# EAGLE design pcb_v2 (EAGLE 8.7.1)
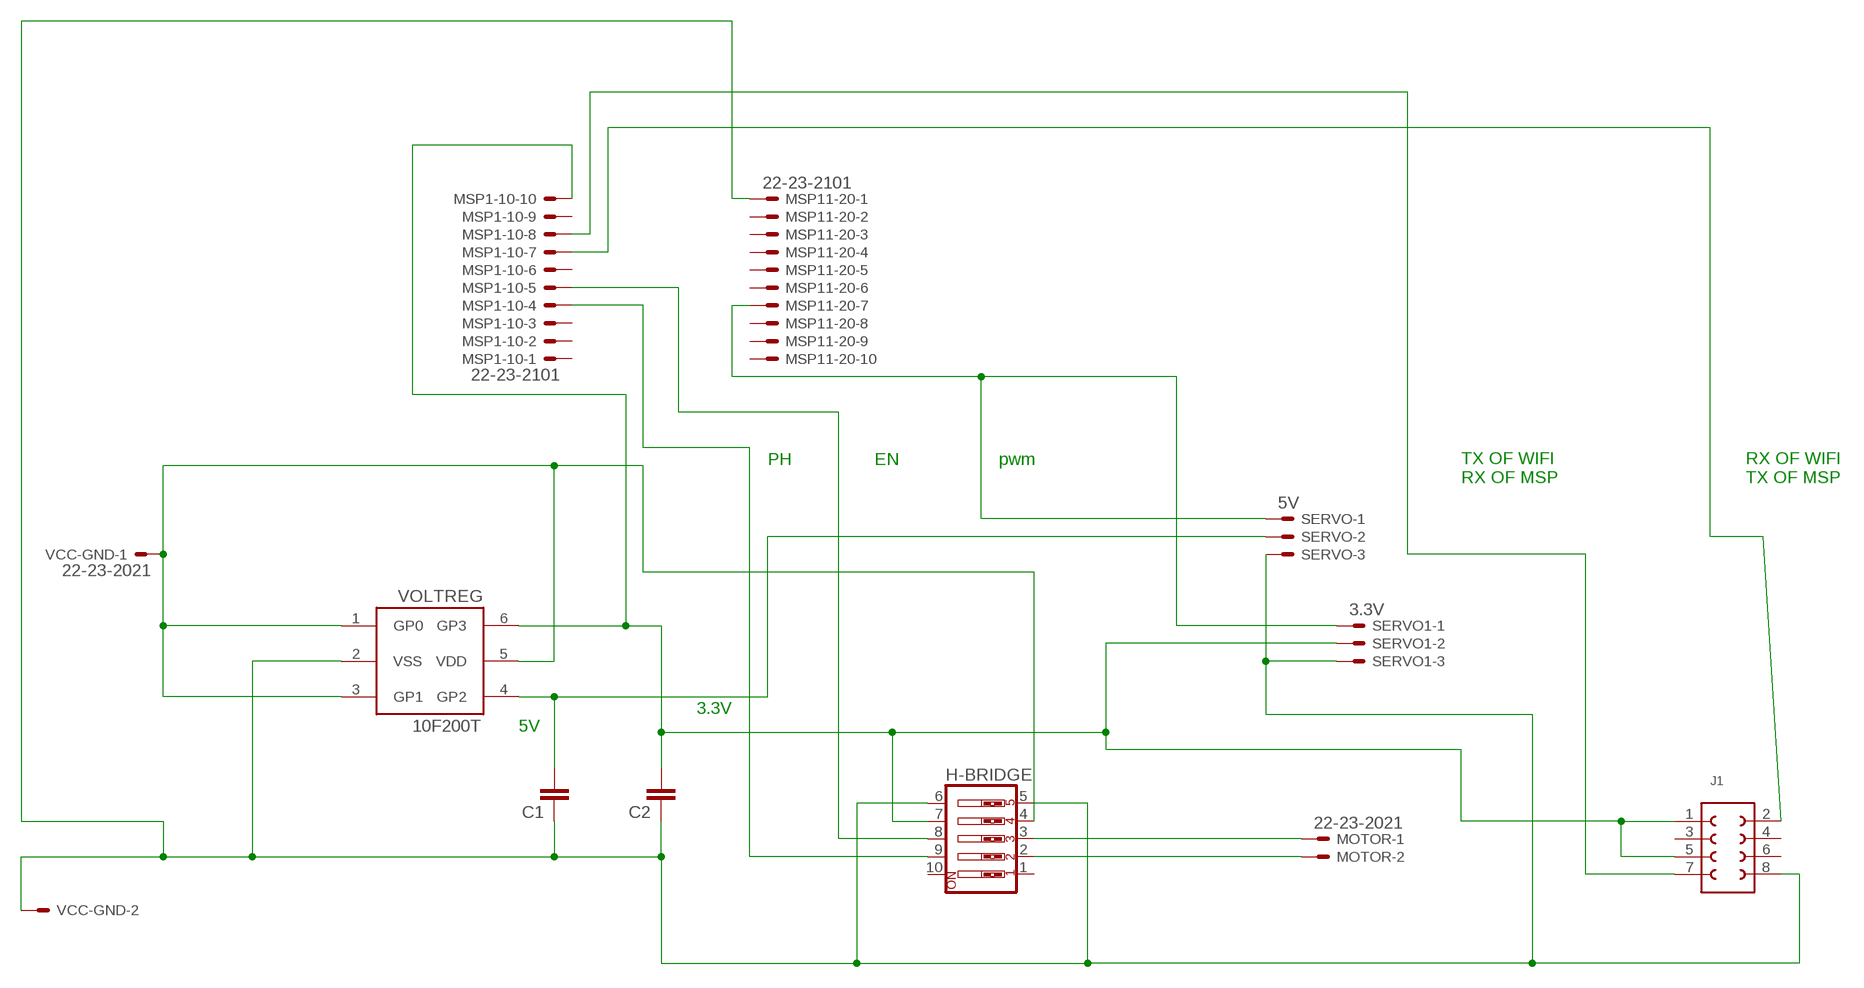
[diagram p0: schematic, sheet 1]

## Parts
C1  C2,5-3  [C2.5-3]
C2  C2,5-3  [C2.5-3]
H-BRIDGE  SW_DIP-5  [EDG-05]
J1  61300821121  [61300821121]
MOTOR  22-23-2021  [22-23-2021]
MSP1-10  22-23-2101  [22-23-2101]
MSP11-20  22-23-2101  [22-23-2101]
SERVO  5V  22-23-2031  [22-23-2031]
SERVO1  3.3V  22-23-2031  [22-23-2031]
VCC-GND  22-23-2021  [22-23-2021]
VOLTREG  10F200T  [SOT23-6]

## Nets
N$1: J1.2 MSP1-10.7
N$3: J1.7 MSP1-10.8
N$4: C2.2 H-BRIDGE.7 J1.1 J1.5 MSP1-10.10 SERVO1.2 VOLTREG.6(GP3)
N$5: H-BRIDGE.3 MOTOR.1
N$6: H-BRIDGE.2 MOTOR.2
N$7: MSP11-20.7 SERVO1.1 SERVO.1
N$10: C1.2 SERVO.2 VOLTREG.4(GP2)
N$11: H-BRIDGE.8 MSP1-10.5
N$12: C1.1 C2.1 H-BRIDGE.5 H-BRIDGE.6 J1.8 MSP11-20.1 SERVO1.3 SERVO.3 VCC-GND.2 VOLTREG.2(VSS)
N$13: H-BRIDGE.9 MSP1-10.4
N$14: H-BRIDGE.4 VCC-GND.1 VOLTREG.1(GP0) VOLTREG.3(GP1) VOLTREG.5(VDD)
Unconnected: H-BRIDGE.1 H-BRIDGE.10 J1.3 J1.4 J1.6 MSP1-10.1 MSP1-10.2 MSP1-10.3 MSP1-10.6 MSP1-10.9 MSP11-20.2 MSP11-20.3 MSP11-20.4 MSP11-20.5 MSP11-20.6 MSP11-20.8 MSP11-20.9 MSP11-20.10

## Notes on the sheet
- PH | EN | pwm
- TX OF WIFI
  RX OF MSP
- RX OF WIFI
  TX OF MSP
- 3.3V
- 5V

## Library data of the parts
C1 C2 = capacitor-wima:C: CAPACITOR naming: grid - package width
H-BRIDGE = special:SW_DIP-5: DIP SWITCH
J1 = Board-to-Board (rev17e):61300821121: Wr-PHD 2.54mm Dual Pin Header, 8 Pins =>Code : Con_BTB_PHD_2.54_2_61300821121 <http://katalog.we-online.de/media/images/eican/Con_BTB_PHD_2.54_2_6130xx21121_pf2.jpg> Details see: http://katalog.we-online.de/en/em/613_0xx_211_21 Created 2014-05-29, Karrer Zheng 2014 (C) Würth Elektronik
MOTOR VCC-GND = con-molex:22-23-2021: .100" (2.54mm) Center Header - 2 Pin; MF: MOLEX; MPN: 22-23-2021; OC_FARNELL: 1462926; OC_NEWARK: 25C3832
MSP1-10 MSP11-20 = con-molex:22-23-2101: .100" (2.54mm) Center Header - 10 Pin; MF: MOLEX; MPN: 22-23-2101; OC_FARNELL: 1756828; OC_NEWARK: 94C0765
SERVO SERVO1 = con-molex:22-23-2031: .100" (2.54mm) Center Header - 3 Pin; MF: MOLEX; MPN: 22-23-2031; OC_FARNELL: 1462950; OC_NEWARK: 30C0862
VOLTREG = adafruit:10F200T: PIC10F200/202/204/206 Ultra-small 8-bit PIC micros in SOT-23-6 and SOIC

## Board
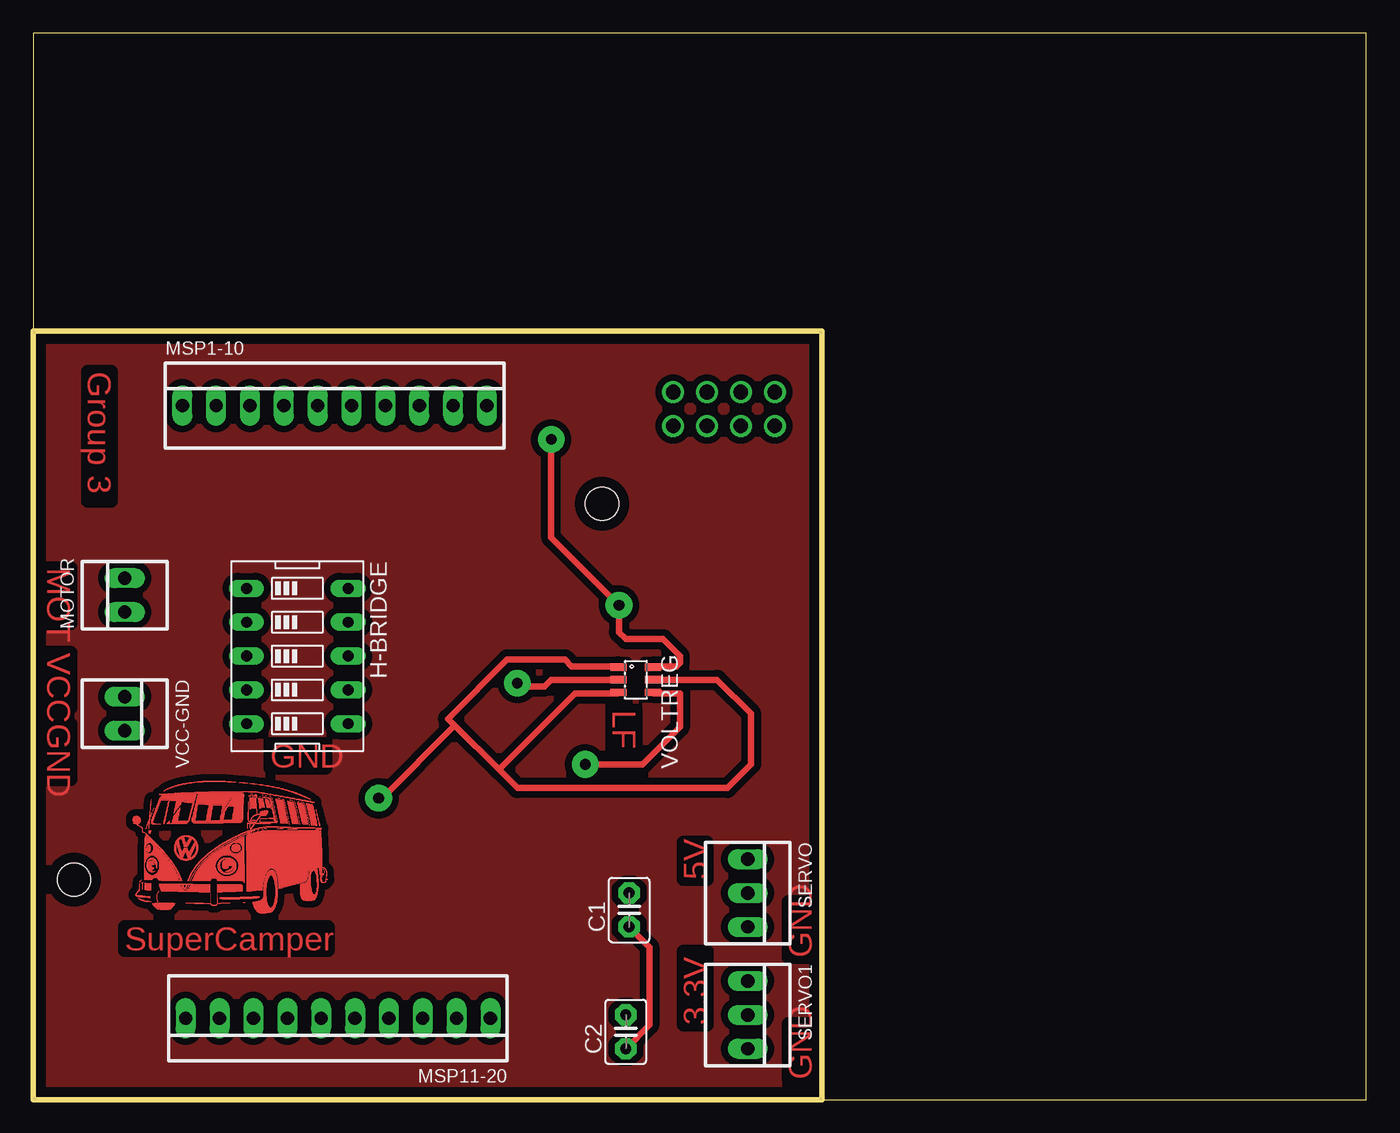
[diagram p1: board, top side]
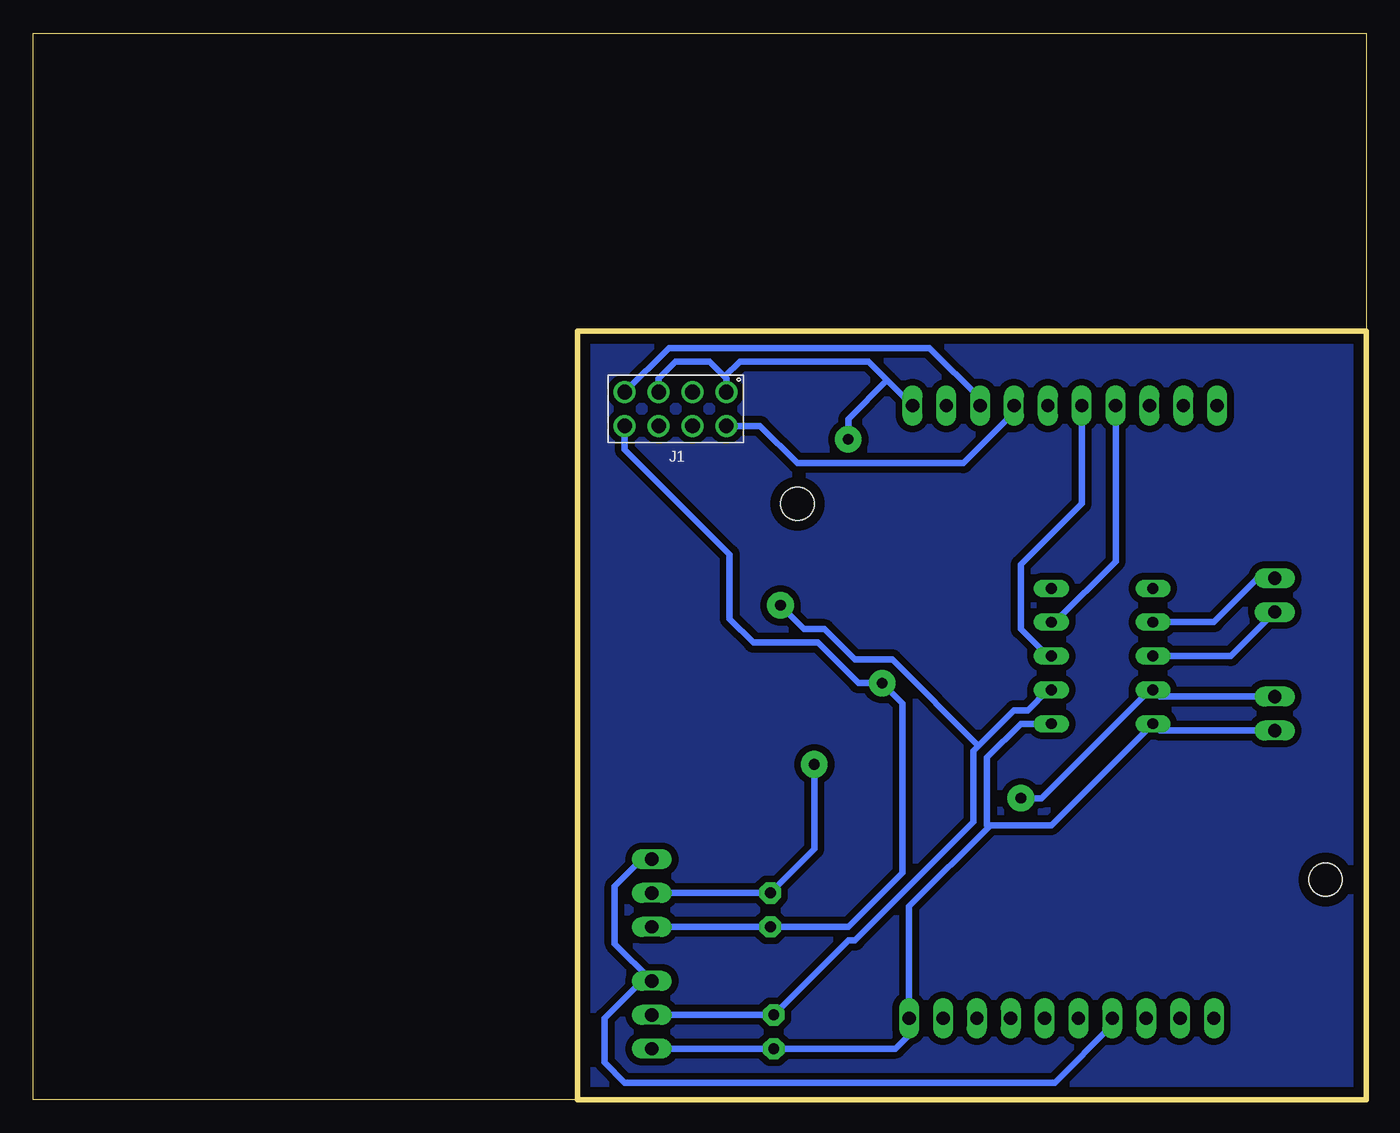
[diagram p2: board, bottom side, seen from below]

Size 100 x 80 mm. Coordinates in mm from the lower left corner, seen from the top.
Outline: 59.18,0 100,0 100,80 0,80 0,0
Outline: 0,0 59.18,0
Outline: 59.18,0 59.18,57.66 0,57.66 0,0
Copper layers (1*16): Top 0.035mm / dielectric 1.5mm / Bottom 0.035mm
Design rules "default *": minimum track width 0.5mm, minimum drill 0.8mm, track to track 0.5mm, track to pad 0.5mm, pad to pad 0.5mm, via to via 0.5mm, smd to smd 8mil, copper to edge 30mil, drill to drill 30mil, minimum pad ring 10mil, minimum via ring 8mil, stop-mask expansion 4mil, vias tented up to drill 0mil, thermal gap 10mil
Holes 2.5 mm at 3.05,16.51 42.67,44.7

### Footprints (pad centres in the part's own frame; a part is rotated, then mirrored left to right if it is on the bottom)
C2.5-3 = drill 0.813 pad 1.6 octagon: 1 -1.27,0; 2 1.27,0
EDG-05 = drill 0.813 long: 1 -5.08,-3.81; 2 -2.54,-3.81; 3 0,-3.81; 4 2.54,-3.81; 5 5.08,-3.81; 6 5.08,3.81; 7 2.54,3.81; 8 0,3.81; 9 -2.54,3.81; 10 -5.08,3.81
61300821121 = drill 1.1: 1 -3.81,-1.27; 2 -3.81,1.27; 3 -1.27,-1.27; 4 -1.27,1.27; 5 1.27,-1.27; 6 1.27,1.27; 7 3.81,-1.27; 8 3.81,1.27
22-23-2021 = drill 1 long: 1 -1.27,0; 2 1.27,0
22-23-2101 = drill 1 long: 1 -11.43,0; 2 -8.89,0; 3 -6.35,0; 4 -3.81,0; 5 -1.27,0; 6 1.27,0; 7 3.81,0; 8 6.35,0; 9 8.89,0; 10 11.43,0
22-23-2031 = drill 1 long: 1 -2.54,0; 2 0,0; 3 2.54,0
SOT23-6 = smd 0.55 x 1.2: 1 -0.95,-1.3; 2 0,-1.3; 3 0.95,-1.3; 4 0.95,1.3; 5 0,1.3; 6 -0.95,1.3

### Placement (x,y rotation side)
C1  44.7,14.22 90 top
C2  44.45,5.08 90 top
H-BRIDGE  19.81,33.27 270 top
J1  51.82,51.82 180 bottom
MOTOR  6.86,37.85 90 top
MSP1-10  22.61,52.07 0 top
MSP11-20  22.86,6.1 180 top
SERVO  53.59,15.49 270 top
SERVO1  53.59,6.35 270 top
VCC-GND  6.86,28.96 270 top
VOLTREG  45.21,31.5 270 top

### Tracks (layer width: path | path; a pad name or v marks a point on that pad's centre or on a via)
N$1
  Bottom 0.5: MSP1-10.7 26.42,51.56 30.23,47.75 42.67,47.75 45.47,50.55 J1.2
N$3
  Bottom 0.5: J1.7 52.32,56.39 32.77,56.39 28.96,52.58 MSP1-10.8
N$4  (via drill 0.8 pad 2)
  Top 0.5: VOLTREG.6 46.58,32.51 48.26,32.51 48.51,32.77 48.51,33.27 47.24,34.54 44.45,34.54 43.94,35.05 v43.94,37.08 38.86,42.16 v38.86,49.53
  Bottom 0.5: SERVO1.2 C2.2 38.86,11.94 38.35,11.94 29.46,20.83 29.46,26.16 29.08,26.54 | 29.08,26.54 26.42,29.21 25.4,29.21 23.88,30.73 H-BRIDGE.7 | J1.5 53.09,54.1 51.82,55.37 49.28,55.37 48.13,54.23 | 48.13,54.23 48.01,54.1 J1.1 | 48.13,54.23 46.99,55.37 37.34,55.37 35.94,53.98 | MSP1-10.10 35.94,53.98 | v43.94,37.08 42.16,35.31 40.64,35.31 38.35,33.02 35.56,33.02 29.08,26.54 | v38.86,49.53 38.86,51.05 35.94,53.98
N$5
  Bottom 0.5: H-BRIDGE.3 10.16,33.27 MOTOR.1
N$6
  Bottom 0.5: H-BRIDGE.2 11.43,35.81 8.13,39.12 MOTOR.2
N$7
  Bottom 0.5: SERVO.1 54.36,18.03 56.39,16 56.39,11.68 SERVO1.1 54.1,9.14 57.15,6.1 57.15,2.79 55.63,1.27 23.37,1.27 19.05,5.59 MSP11-20.7
N$9
  pour Top: 0,57.66 59.18,57.66 59.18,0 0,0
N$10  (via drill 0.8 pad 2)
  Top 0.5: VOLTREG.4 46.58,30.48 48.51,30.48 48.51,27.94 45.72,25.15 45.47,25.15 v41.4,25.15 41.4,25.65
  Bottom 0.5: SERVO.2 C1.2 41.4,18.8 v41.4,25.15
N$11
  Bottom 0.5: H-BRIDGE.8 23.88,33.27 25.91,35.31 25.91,40.13 21.34,44.7 MSP1-10.5
N$12  (via drill 0.8 pad 2)
  Top 0.5: C2.1 46.23,5.59 46.23,11.43 C1.1 | v36.32,31.24 36.32,30.99 38.35,30.99 38.86,31.5 VOLTREG.2
  Bottom 0.5: SERVO.3 C1.1 38.86,12.95 34.8,17.02 34.8,29.72 v36.32,31.24 38.1,31.24 41.15,34.29 45.97,34.29 47.75,36.07 47.75,40.89 55.63,48.77 J1.8 | VCC-GND.2 15.49,27.69 H-BRIDGE.5 23.62,20.57 28.19,20.57 | 23.62,27.94 H-BRIDGE.6 25.91,28.19 28.45,25.65 28.45,20.57 28.19,20.57 | SERVO1.3 C2.1 35.31,3.81 34.29,4.83 MSP11-20.1 34.29,14.48 28.19,20.57
N$13
  Bottom 0.5: MSP1-10.4 18.8,40.39 23.37,35.81 H-BRIDGE.9
N$14  (via drill 0.8 pad 2)
  Top 0.5: 43.5,32.45 VOLTREG.1 43.85,32.51 40.39,32.51 39.88,33.02 35.56,33.02 31.11,28.57 31.62,28.07 | 34.92,24.77 36.32,23.37 52.07,23.37 53.85,25.15 53.85,28.96 51.31,31.5 VOLTREG.5 | 34.92,24.77 31.62,28.07 | 34.92,24.77 40.64,30.48 43.85,30.48 VOLTREG.3 | 31.62,28.07 26.16,22.61 v25.91,22.61
  Bottom 0.5: VCC-GND.1 15.49,30.23 H-BRIDGE.4 16,30.48 16.51,30.48 24.38,22.61 v25.91,22.61
N$15
  pour Bottom: 59.18,0 59.18,57.66 0,57.66 0,0
(copper drawn outside any net)
  shapes: Top area x4423

### Text on the board
Top: Group 3 | MOT | VCC | LF | GND | GND | 5V | SuperCamper | GND | 3.3V | GND
tPlace: C:/Users/mrdav/Desktop/EE579/SuperCamper/PCB/Logo2.bmp